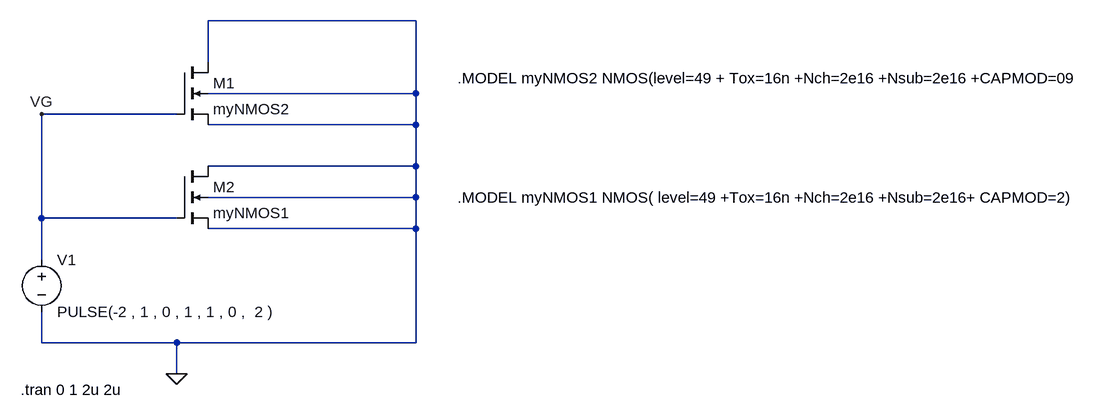
[diagram p0: schematic TP3.asc]
TP3.asc, the LTspice schematic file:
Version 4
SHEET 1 1768 680
WIRE 560 16 240 16
WIRE 240 80 240 16
WIRE 560 128 560 16
WIRE 560 128 240 128
WIRE 192 160 -16 160
WIRE 560 176 560 128
WIRE 560 176 240 176
WIRE 560 240 560 176
WIRE 560 240 240 240
WIRE 560 288 560 240
WIRE 560 288 240 288
WIRE -16 320 -16 160
WIRE 192 320 -16 320
WIRE 560 336 560 288
WIRE 560 336 240 336
WIRE -16 384 -16 320
WIRE -16 512 -16 464
WIRE 192 512 -16 512
WIRE 560 512 560 336
WIRE 560 512 192 512
WIRE 192 560 192 512
FLAG 192 560 0
FLAG -16 160 VG
SYMBOL nmos4 192 80 R0
SYMATTR InstName M1
SYMATTR Value myNMOS2
SYMATTR Value2 level=49 l=85u w=85u Tox=16n Nch=2e16 Nsub=2e16 CAPMOD=0
SYMBOL nmos4 192 240 R0
SYMATTR InstName M2
SYMATTR Value myNMOS1
SYMATTR Value2 myNMOS2 level=49 l=85u w=85u Tox=16n Nch=2e16 Nsub=2e16 CAPMOD=2
SYMBOL voltage -16 368 R0
WINDOW 123 0 0 Left 0
WINDOW 39 0 0 Left 0
SYMATTR InstName V1
SYMATTR Value PULSE(-2 , 1 , 0 , 1 , 1 , 0 ,  2 )
TEXT 624 104 Left 2 !.MODEL myNMOS2 NMOS(level=49 + Tox=16n +Nch=2e16 +Nsub=2e16 +CAPMOD=09
TEXT 624 288 Left 2 !.MODEL myNMOS1 NMOS( level=49 +Tox=16n +Nch=2e16 +Nsub=2e16+ CAPMOD=2)
TEXT -48 584 Left 2 !.tran 0 1 2u 2u

The netlist it stands for:
* TP3.asc
M1 0 VG 0 0 myNMOS2 level=49 l=85u w=85u Tox=16n Nch=2e16 Nsub=2e16 CAPMOD=0
M2 0 VG 0 0 myNMOS1 myNMOS2 level=49 l=85u w=85u Tox=16n Nch=2e16 Nsub=2e16 CAPMOD=2
V1 VG 0 PULSE(-2 , 1 , 0 , 1 , 1 , 0 ,  2 )
.model NMOS NMOS
.model PMOS PMOS
.lib standard.mos
.MODEL myNMOS2 NMOS(level=49 + Tox=16n +Nch=2e16 +Nsub=2e16 +CAPMOD=09
.MODEL myNMOS1 NMOS( level=49 +Tox=16n +Nch=2e16 +Nsub=2e16+ CAPMOD=2)
.tran 0 1 2u 2u
.backanno
.end